# Altium schematic sheet PG3 SHEET1.schdoc
size B; Date: 2/10/2009; ApprovedBy: Touraj; DrawnBy: Juan A. Nadal; Engineer: Touraj; Organization: ActiveWave; Address1: 902 Clint Moore Rd., Suite 118; Address2: Boca Raton; Address3: FL, 33487; Address4: 561-999-9422; DocumentNumber: 3; Revision: 20; SheetNumber: 3; SheetTotal: 4; PageSetup: Record=PageOptions|CenterHorizontal=True|CenterVertical=True|PrintScale=0.70|XCorrection=1.00|YCorrection=1.00|PrintKind=0|BorderSize=5000000|LeftOffset=0|BottomOffset=0|Orientation=2|PaperLength=1000|PaperWidth=1000|Scale=100|PaperSource=7|PrintQuality=-4|MediaType=1|DitherType=10|PaperKind=Letter|PrintScaleMode=1; Project: Tag105
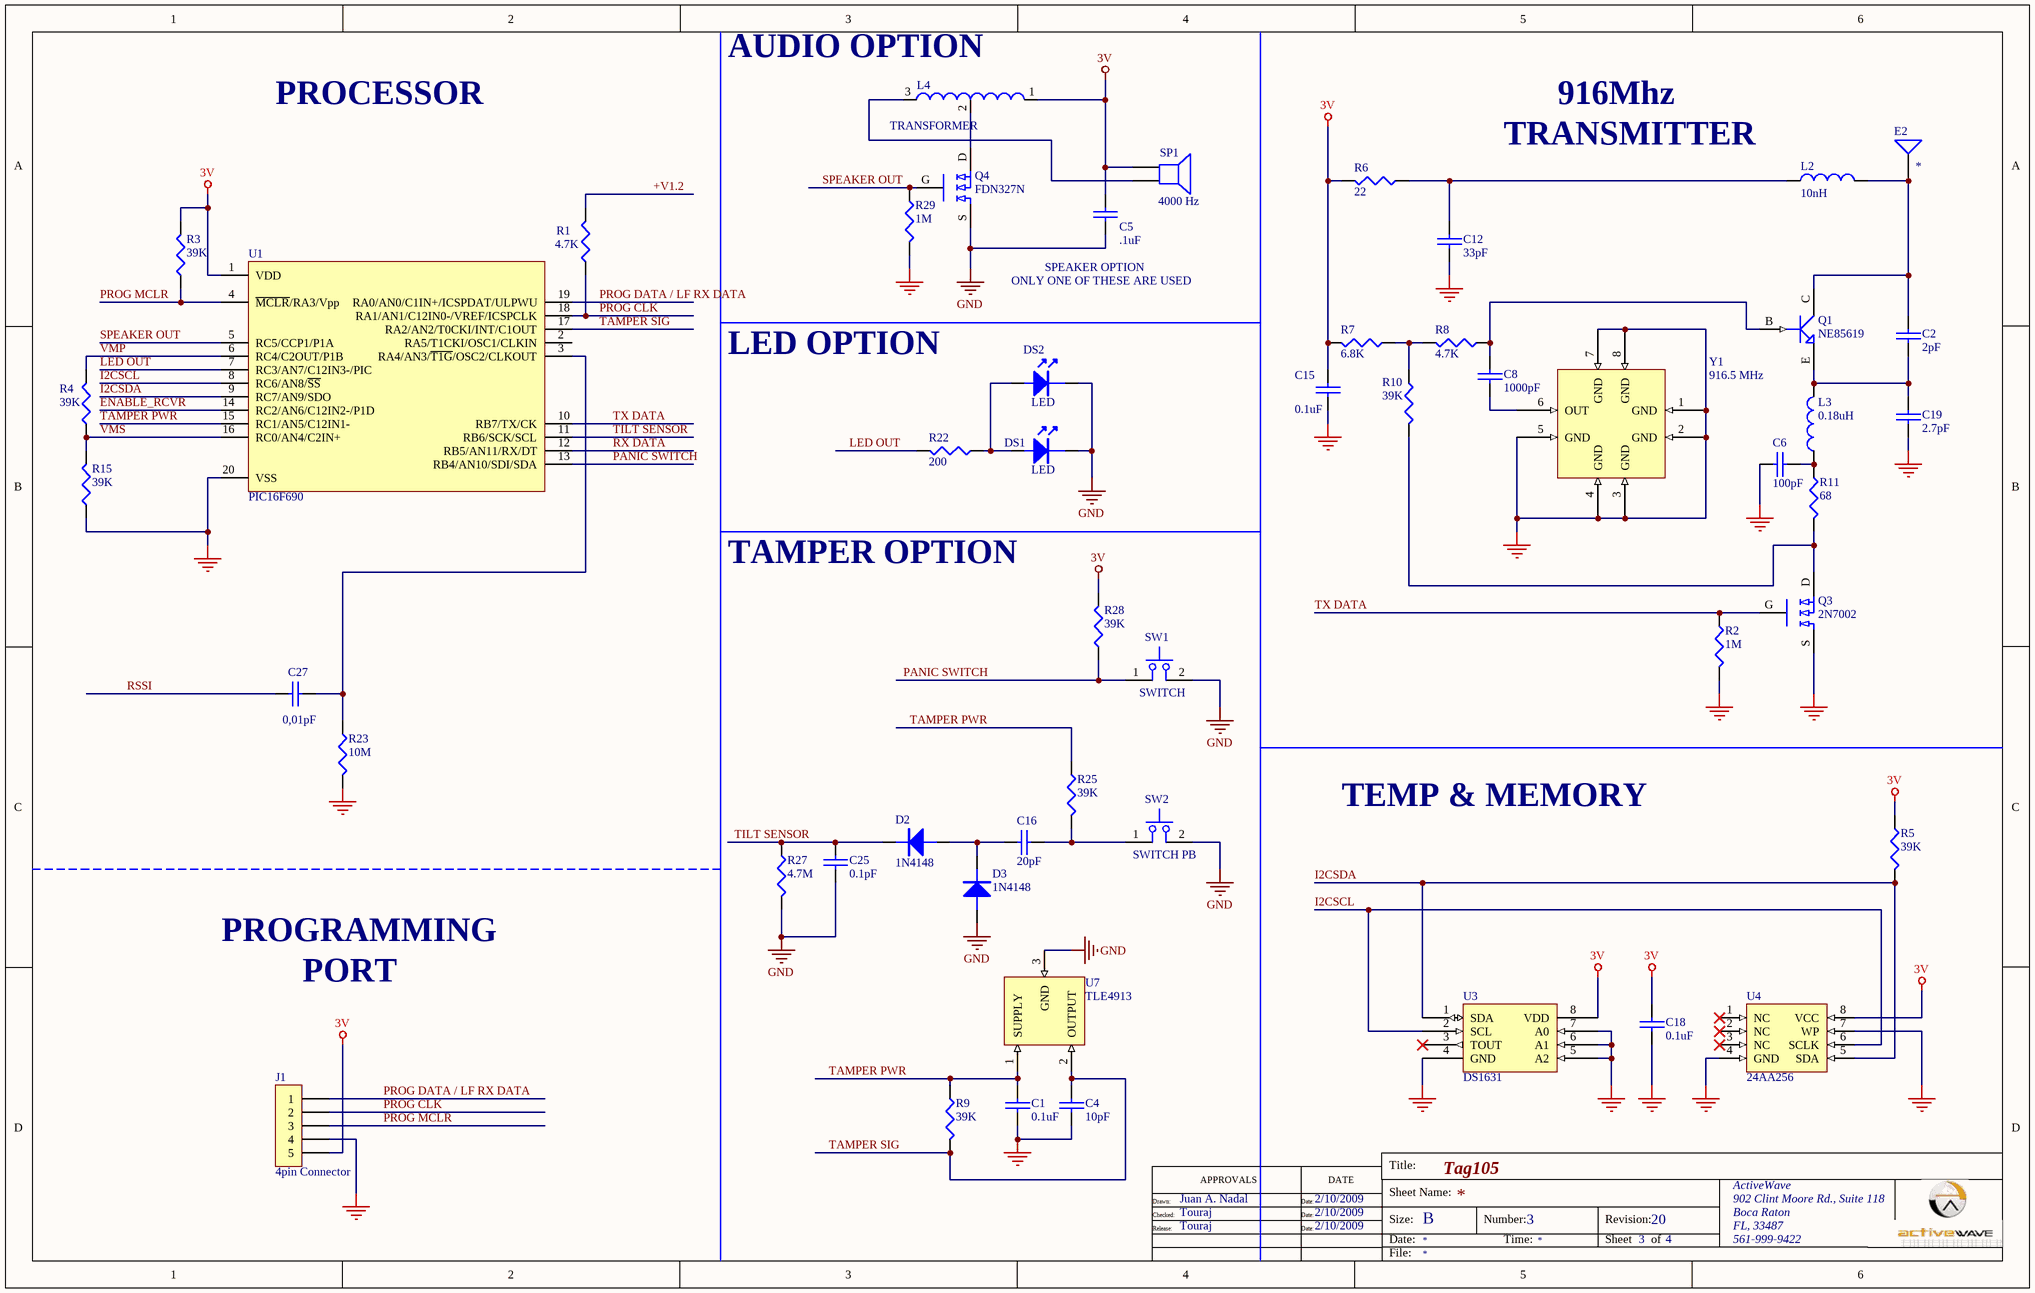
[diagram p0: PG3 SHEET1.schdoc]

## Parts
C1  0.1uF  [0603]
C2  2pF  [0603]
C4  10pF  [0603]
C5  .1uF  [0603]
C6  100pF  [0603]
C8  1000pF  [0603]
C12  33pF  [0603]
C15  0.1uF  [0603]
C16  20pF  [0603]
C18  0.1uF  [0603]
C19  2.7pF  [0603]
C25  0.1pF  [0603]
C27  0,01pF  [0603]
D2  1N4148  [sod123_021405]
D3  1N4148  [sod123_021405]
DS1  LED  [404-1032-2-ND]
DS2  LED  [LCE-358RP]
E2  *  [Antenna1]
J1  4pin Connector  [1X5 HEADER]
L2  10nH  [0603]
L3  0.18uH  [0603]
L4  TRANSFORMER  [COIL_6mmx6mm_011012]
Q1  NE85619  [3 PIN ULTRA SUPER MINI MOLD]
Q3  2N7002  [SOT23 FET]
Q4  FDN327N  [SOT23 FET]
R1  4.7K  [0603]
R2  1M
R3  39K  [0603]
R4  39K  [0603]
R5  39K  [0603]
R6  22
R7  6.8K
R8  4.7K
R9  39K  [0603]
R10  39K  [0603]
R11  68
R15  39K  [0603]
R22  200  [0603]
R23  10M  [0603]
R25  39K  [0603]
R27  4.7M  [0603]
R28  39K  [0603]
R29  1M  [0603]
SP1  4000 Hz  [SPEAKER 12mmx12mm_011012]
SW1  SWITCH  [SWITCH PB REVERSED_082907]
SW2  SWITCH PB  [SQ-SEN-200]
U1  PIC16F690  [SSOP20 WIDE]
U3  DS1631  [SO8 SMALL]
U4  24AA256  [SO8]
U7  TLE4913  [SOT23W]
Y1  916.5 MHz  [RESONATOR]

## Nets
3V: C5.1 C15.1 C18.1 J1.5 L4.1 R3.2 R5.1 R6.2 R7.2 R28.2 SP1.1 U1.1(VDD) U3.8(VDD) U4.8(VCC)
GND: C1.2 C4.2 C5.2 C6.2 C12.2 C15.2 C18.2 C19.2 C25.2 D3.A DS1.K DS2.2 J1.4 Q3.S Q4.S R2.2 R15.1 R23.2 R27.2 R29.2 SW1.2 SW2.2 U1.20(VSS) U3.4(GND) U3.5(A2) U3.6(A1) U3.7(A0) U4.4(GND) U4.7(WP) U7.3(GND) Y1.1(GND) Y1.2(GND) Y1.3(GND) Y1.4(GND) Y1.5(GND) Y1.7(GND) Y1.8(GND)
+V1.2: R1.2
ENABLE_RCVR: U1.14(RC2/AN6/C12IN2-/P1D)
I2CSCL: U1.8(RC6/AN8/~{SS}) U3.2(SCL) U4.6(SCLK)
I2CSDA: R5.2 U1.9(RC7/AN9/SDO) U3.1(SDA) U4.5(SDA)
LED OUT: R22.2 U1.7(RC3/AN7/C12IN3-/PIC)
PANIC SWITCH: R28.1 SW1.1 U1.13(RB4/AN10/SDI/SDA)
PROG CLK: J1.2 R1.1 U1.18(RA1/AN1/C12IN0-/VREF/ICSPCLK)
PROG DATA / LF RX DATA: J1.1 U1.19(RA0/AN0/C1IN+/ICSPDAT/ULPWU)
PROG MCLR: J1.3 R3.1 U1.4(~{MCLR}/RA3/Vpp)
RSSI: C27.1
RX DATA: U1.12(RB5/AN11/RX/DT)
SPEAKER OUT: Q4.G R29.1 U1.5(RC5/CCP1/P1A)
TAMPER PWR: C1.1 R9.1 R25.1 U1.15(RC1/AN5/C12IN1-) U7.1(SUPPLY)
TAMPER SIG: C4.1 R9.2 U1.17(RA2/AN2/T0CKI/INT/C1OUT) U7.2(OUTPUT)
TILT SENSOR: C25.1 D2.K R27.1 U1.11(RB6/SCK/SCL)
TX DATA: Q3.G R2.1 U1.10(RB7/TX/CK)
VMP: R4.2 U1.6(RC4/C2OUT/P1B)
VMS: R4.1 R15.2 U1.16(RC0/AN4/C2IN+)
NetC2_1: C2.1 E2.1 L2.2 Q1.C
NetC2_2: C2.2 C19.1 L3.2 Q1.E
NetC6_1: C6.1 L3.1 R11.1
NetC8_1: C8.1 Q1.B R8.1
NetC8_2: C8.2 Y1.6(OUT)
NetC12_1: C12.1 L2.1 R6.1
NetC16_1: C16.1 R25.2 SW2.1
NetC16_2: C16.2 D2.A D3.K
NetC27_2: C27.2 R23.1 U1.3(RA4/AN3/~{T1G}/OSC2/CLKOUT)
NetDS1_A: DS1.A DS2.1 R22.1
NetL4_2: L4.2 Q4.D
NetL4_3: L4.3 SP1.2
NetQ3_D: Q3.D R10.2 R11.2
NetR7_1: R7.1 R8.2 R10.1

Not connected (* = marked no-connect by the designer): U1 2(RA5/T1CKI/OSC1/CLKIN); U3 3(TOUT)*; U4 1(NC)* 2(NC)* 3(NC)*

## Notes on the sheet
- (near L4) AUDIO OPTION
- PROCESSOR
- TRANSMITTER
- 916Mhz
- ONLY ONE OF THESE ARE USED
- (near C5) SPEAKER OPTION
- LED OPTION
- TAMPER OPTION
- TEMP & MEMORY
- PROGRAMMING
- PORT
- APPROVALS
- DATE
- Title:
- Drawn:
- Checked:
- Release:
- Date:
- Size:
- Sheet Name:
- B
- Number:
- Time:
- Revision:
- Sheet
- of
- File:

## Library data of the parts
C1 C2 C4-C6 C8 C12 C15 C16 C18 C19 C25 C27 = CAP-0603: Capacitor; ACTIVEWAVE-P/N: *; ITEM-DESCRIPTION: *; MANUFACTURER: *; MFGR-P/N: *
  C1 C15 C18: VALUE: 0.1uF
  C2: VALUE: 2pF
  C4: VALUE: 10pF
  C5: VALUE: .1uF
  C6: VALUE: 100pF
  C8: VALUE: 1000pF
  C12: VALUE: 33pF
  C16: VALUE: 20pF
  C19: VALUE: 2.7pF
  C25: VALUE: 0.1pF
  C27: VALUE: 0,01pF
D2 D3 = DIODE: ACTIVEWAVE-P/N: *; ITEM-DESCRIPTION: *; MANUFACTURER: *; MFGR-P/N: *; VALUE: 1N4148
DS2 = LCE-358RP: X-Bring Red Power SMD LED Emitter; MANUFACTURER: L.C. LED; ACTIVEWAVE-P/N: *; ITEM-DESCRIPTION: X-Bring Red Power SMD LED Emitter; MFGR-P/N: LCE-358RP; Value: LED
E2 = Antenna1: VALUE: *
J1 = CON5-1: Connector; ACTIVEWAVE-P/N: *; ITEM-DESCRIPTION: *; MANUFACTURER: *; MFGR-P/N: *; VALUE: 4pin Connector
L2 L3 = INDUCTOR: ACTIVEWAVE-P/N: *; ITEM-DESCRIPTION: *; MANUFACTURER: *; MFGR-P/N: *
  L2: VALUE: 10nH
  L3: VALUE: 0.18uH
L4 = INDUCTOR_V2: VALUE: TRANSFORMER
Q1 = NE85619: TRANSISTOR NPN 1GHZ SMD; MANUFACTURER: ??????; ACTIVEWAVE-P/N: *; ITEM-DESCRIPTION: TRANSISTOR NPN 1GHZ SMD; MFGR-P/N: ??????; VALUE: NE85619
Q3 = 2N7002: N-CHANNEL ENHANCEMENT MODE FIELD EFFECT TRANSISTOR; MANUFACTURER: FAIRCHILD; ACTIVEWAVE-P/N: *; ITEM-DESCRIPTION: N-CHANNEL ENHANCEMENT MODE FIELD EFFECT TRANSISTOR; MFGR-P/N: 2N7002; VALUE: 2N7002
Q4 = FDN327N: 20V N-Channel MOSFET; MANUFACTURER: FAIRCHILD; ITEM-DESCRIPTION: N-CHANNEL 1.8 VGS SPECIFIED POWERTRENCH MOSFET; ACTIVEWAVE-P/N: *; MFGR-P/N: FDN327N; VALUE: FDN327N
R1 = RESISTOR: Text Field1: 20; Text Field2: 30
R2 R6-R8 R11 R29 = RES-0402: ACTIVEWAVE-P/N: *; MFGR-P/N: *; MANUFACTURER: *; ITEM-DESCRIPTION: *
  R2 R29: VALUE: 1M
  R6: VALUE: 22
  R7: VALUE: 6.8K
  R8: VALUE: 4.7K
  R11: VALUE: 68
R3-R5 R9 R10 R15 R22 R23 R25 R27 R28 = RES-0603: ACTIVEWAVE-P/N: *; MFGR-P/N: *; MANUFACTURER: *; ITEM-DESCRIPTION: *
  R3-R5 R9 R10 R15 R25 R28: VALUE: 39K
  R22: VALUE: 200
  R23: VALUE: 10M
  R27: VALUE: 4.7M
SP1 = SMT-1028-S-R: Surface Mount Transducer; MANUFACTURER: PUI Audio; ITEM-DESCRIPTION: Audio Indicators & Alerts EM 98dB 2830H 3.6Vpp; ACTIVEWAVE-P/N: *; MFGR-P/N: CMT-1203; VALUE: 4000 Hz
U1 = PIC16F690-E/P: Microcontrollers (MCU) 7KB FL 256R 18 I/O; MANUFACTURER: Microchip; ACTIVEWAVE-P/N: *; ITEM-DESCRIPTION: Microcontrollers (MCU) 7KB FL 256R 18 I/O; MFGR-P/N: PIC16F690-E/P; VALUE: PIC16F690
U3 = DS1631: High-Precision Digital Thermometer and Thermostat; MANUFACTURER: DALLAS SEMICONDUCTOR; MFGR-P/N: ??????; ACTIVEWAVE-P/N: *; ITEM-DECRIPTION: High-Precision Digital Thermometer and Thermostat; VALUE: DS1631
U4 = 24AA256-I/P: 24AA256 32k Microchip Serial EEPROM; ACTIVEWAVE-P/N: *; MFGR-P/N: 24AA256-I/P; MANUFACTURER: Microchip; ITEM-DESCRIPTION: 24AA256 32k Microchip Serial EEPROM; VALUE: 24AA256
U7 = TLE4913: Low Power Hall Switch; MANUFACTURER: Infineon Technologies AG; ACTIVEWAVE-P/N: *; ITEM-DESCRIPTION: Low Power Hall Switch; MFGR-P/N: TLE4913; VALUE: TLE4913
Y1 = RESONATOR: 916.5 MHz Saw Resonator; MANUFACTURER: ??????; ACTIVEWAVE-P/N: *; ITEM-DESCRIPTION: 916.5 MHz Saw Resonator; MFGR-P/N: ??????; VALUE: 916.5 MHz
DS1 = LED: ACTIVEWAVE-P/N: *; ITEM-DESCRIPTION: *; MANUFACTURER: *; MFGR-P/N: *; VALUE: LED
SW1 = SWITCH: ACTIVEWAVE-P/N: *; ITEM-DESCRIPTION: *; MANUFACTURER: *; MFGR-P/N: *; VALUE: SWITCH
SW2 = SWITCH PB: ACTIVEWAVE-P/N: *; ITEM-DESCRIPTION: *; MANUFACTURER: *; MFGR-P/N: *; VALUE: SWITCH PB